# EasyEDA schematic SCH_Arduino扩展板_V1_2023-10-04.json

## Sheets
1 连接器: TITLE: Sheet_1; REV: 1.0; Date: 2022-09-22; Sheet: 1/1; Company: Your Company
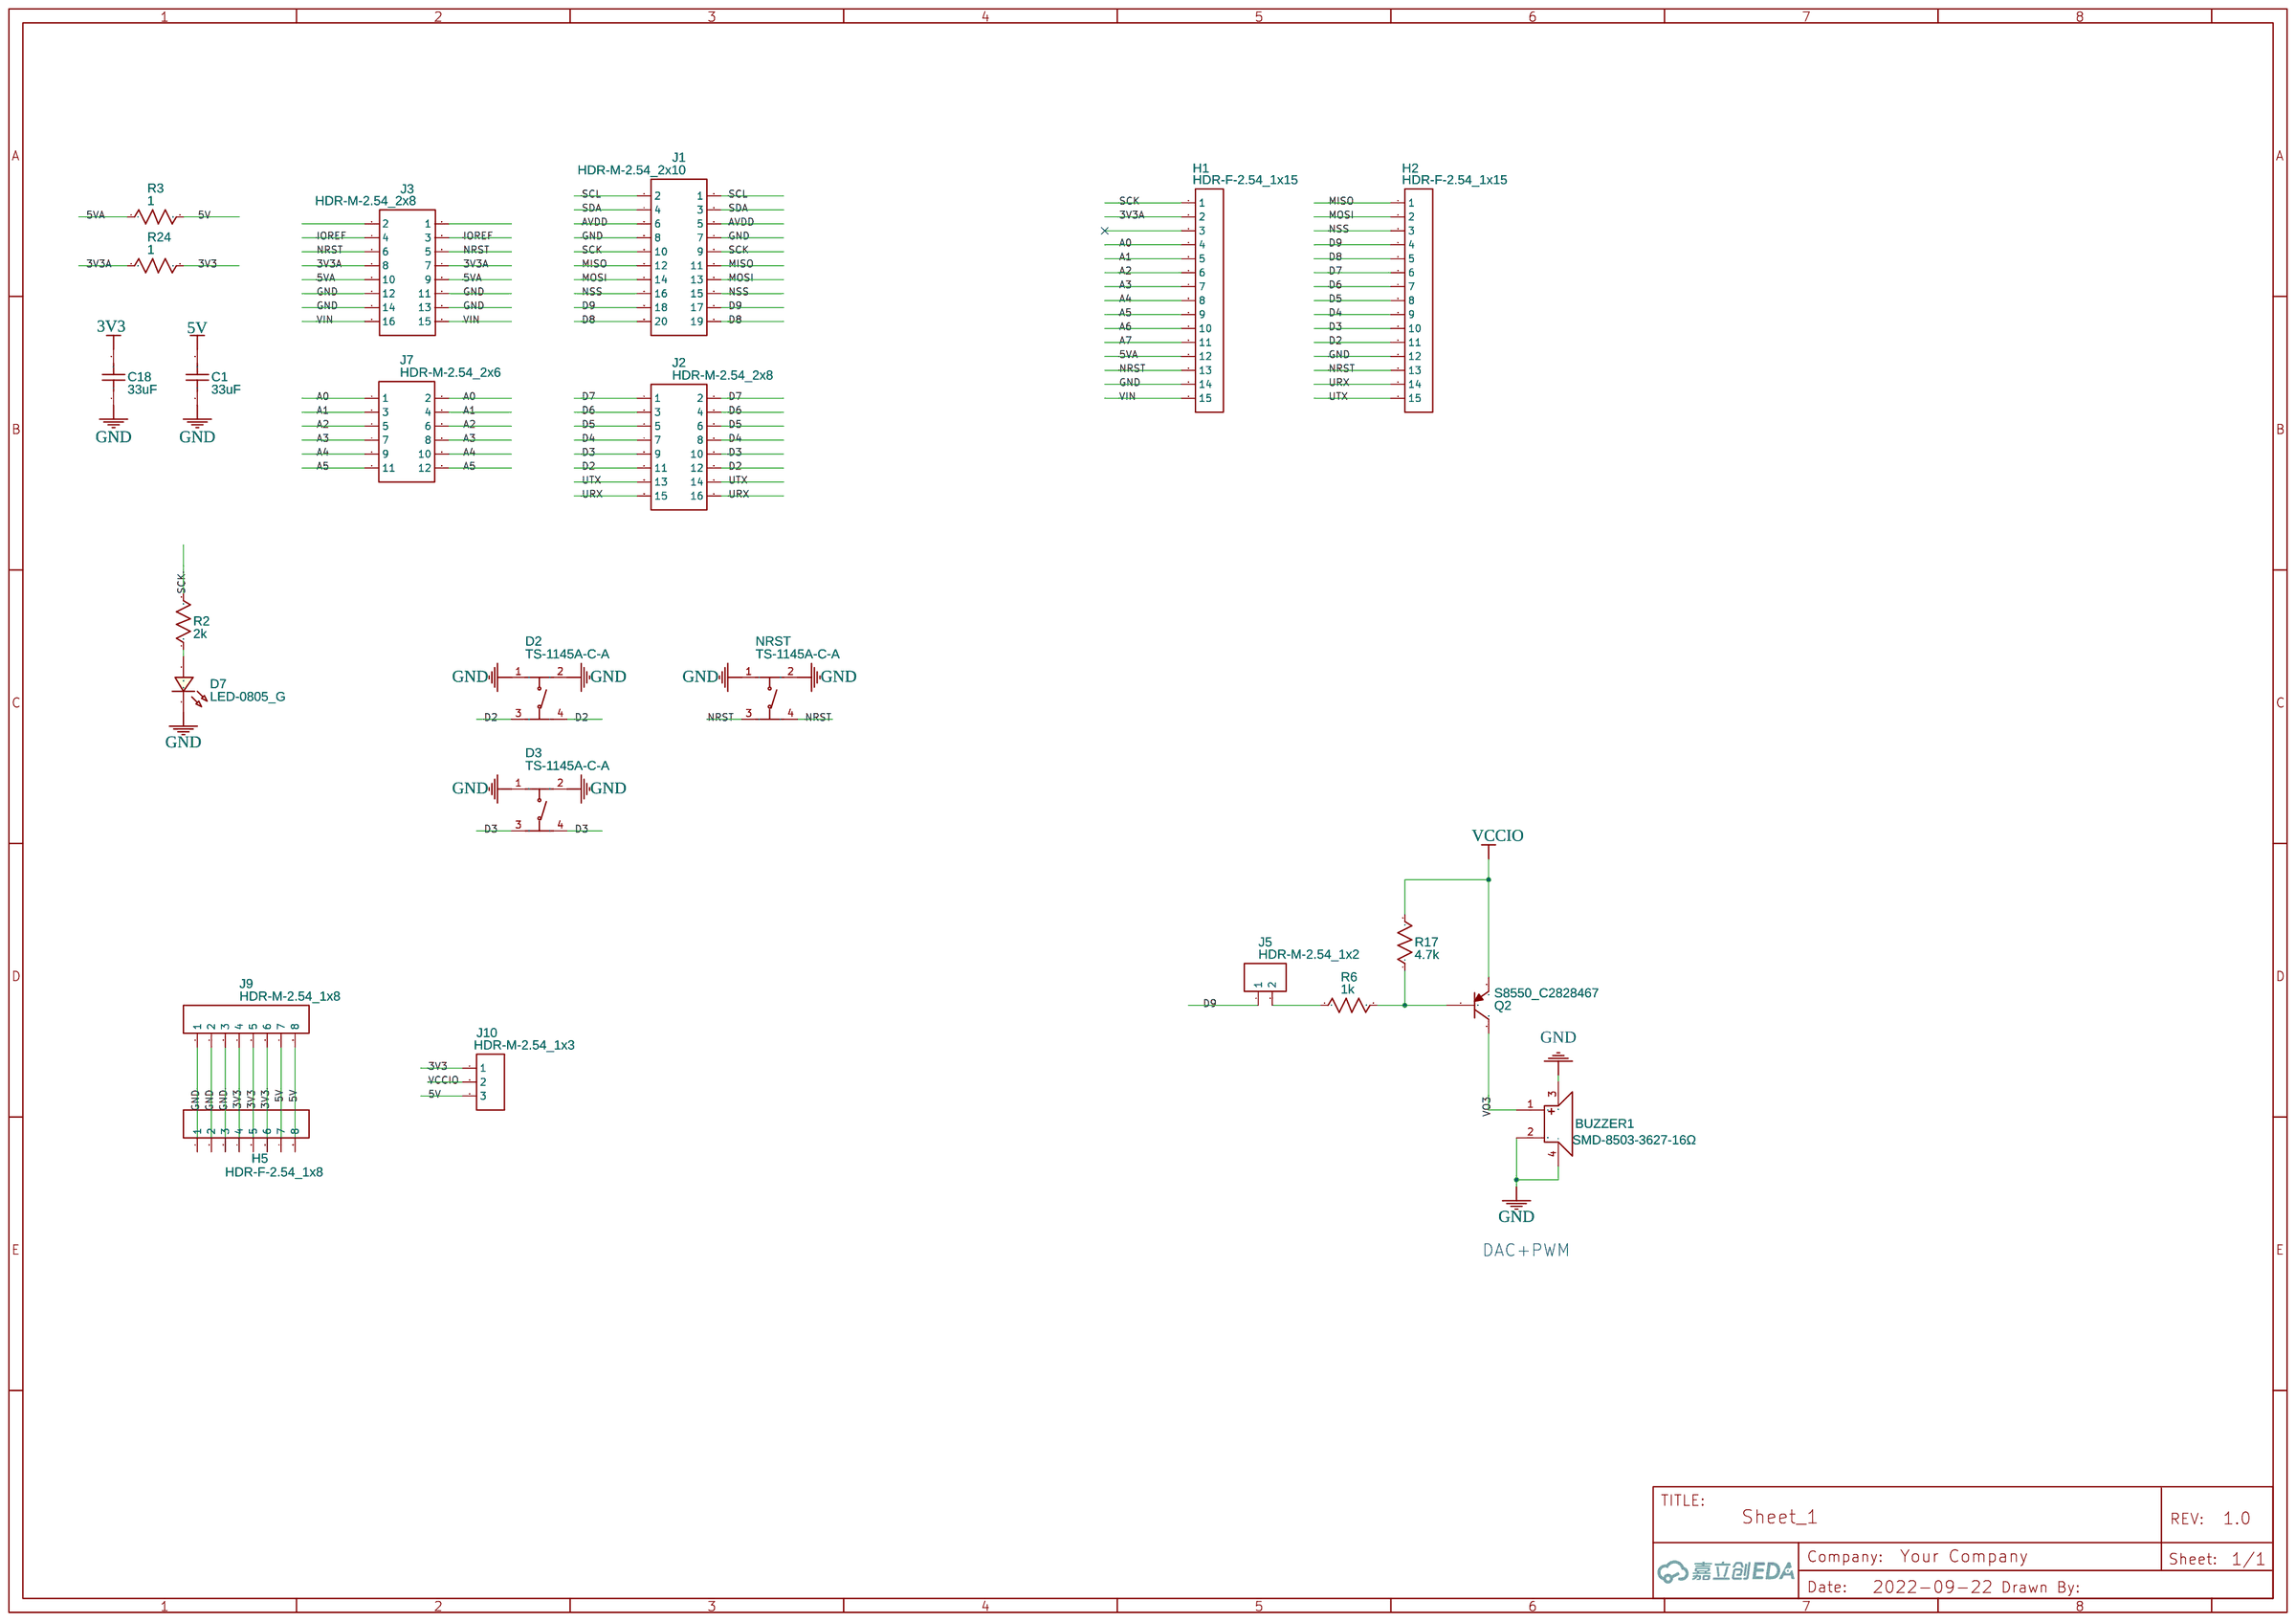
[diagram p0: 连接器]
2 连接器扩展: Date: 2022-10-17
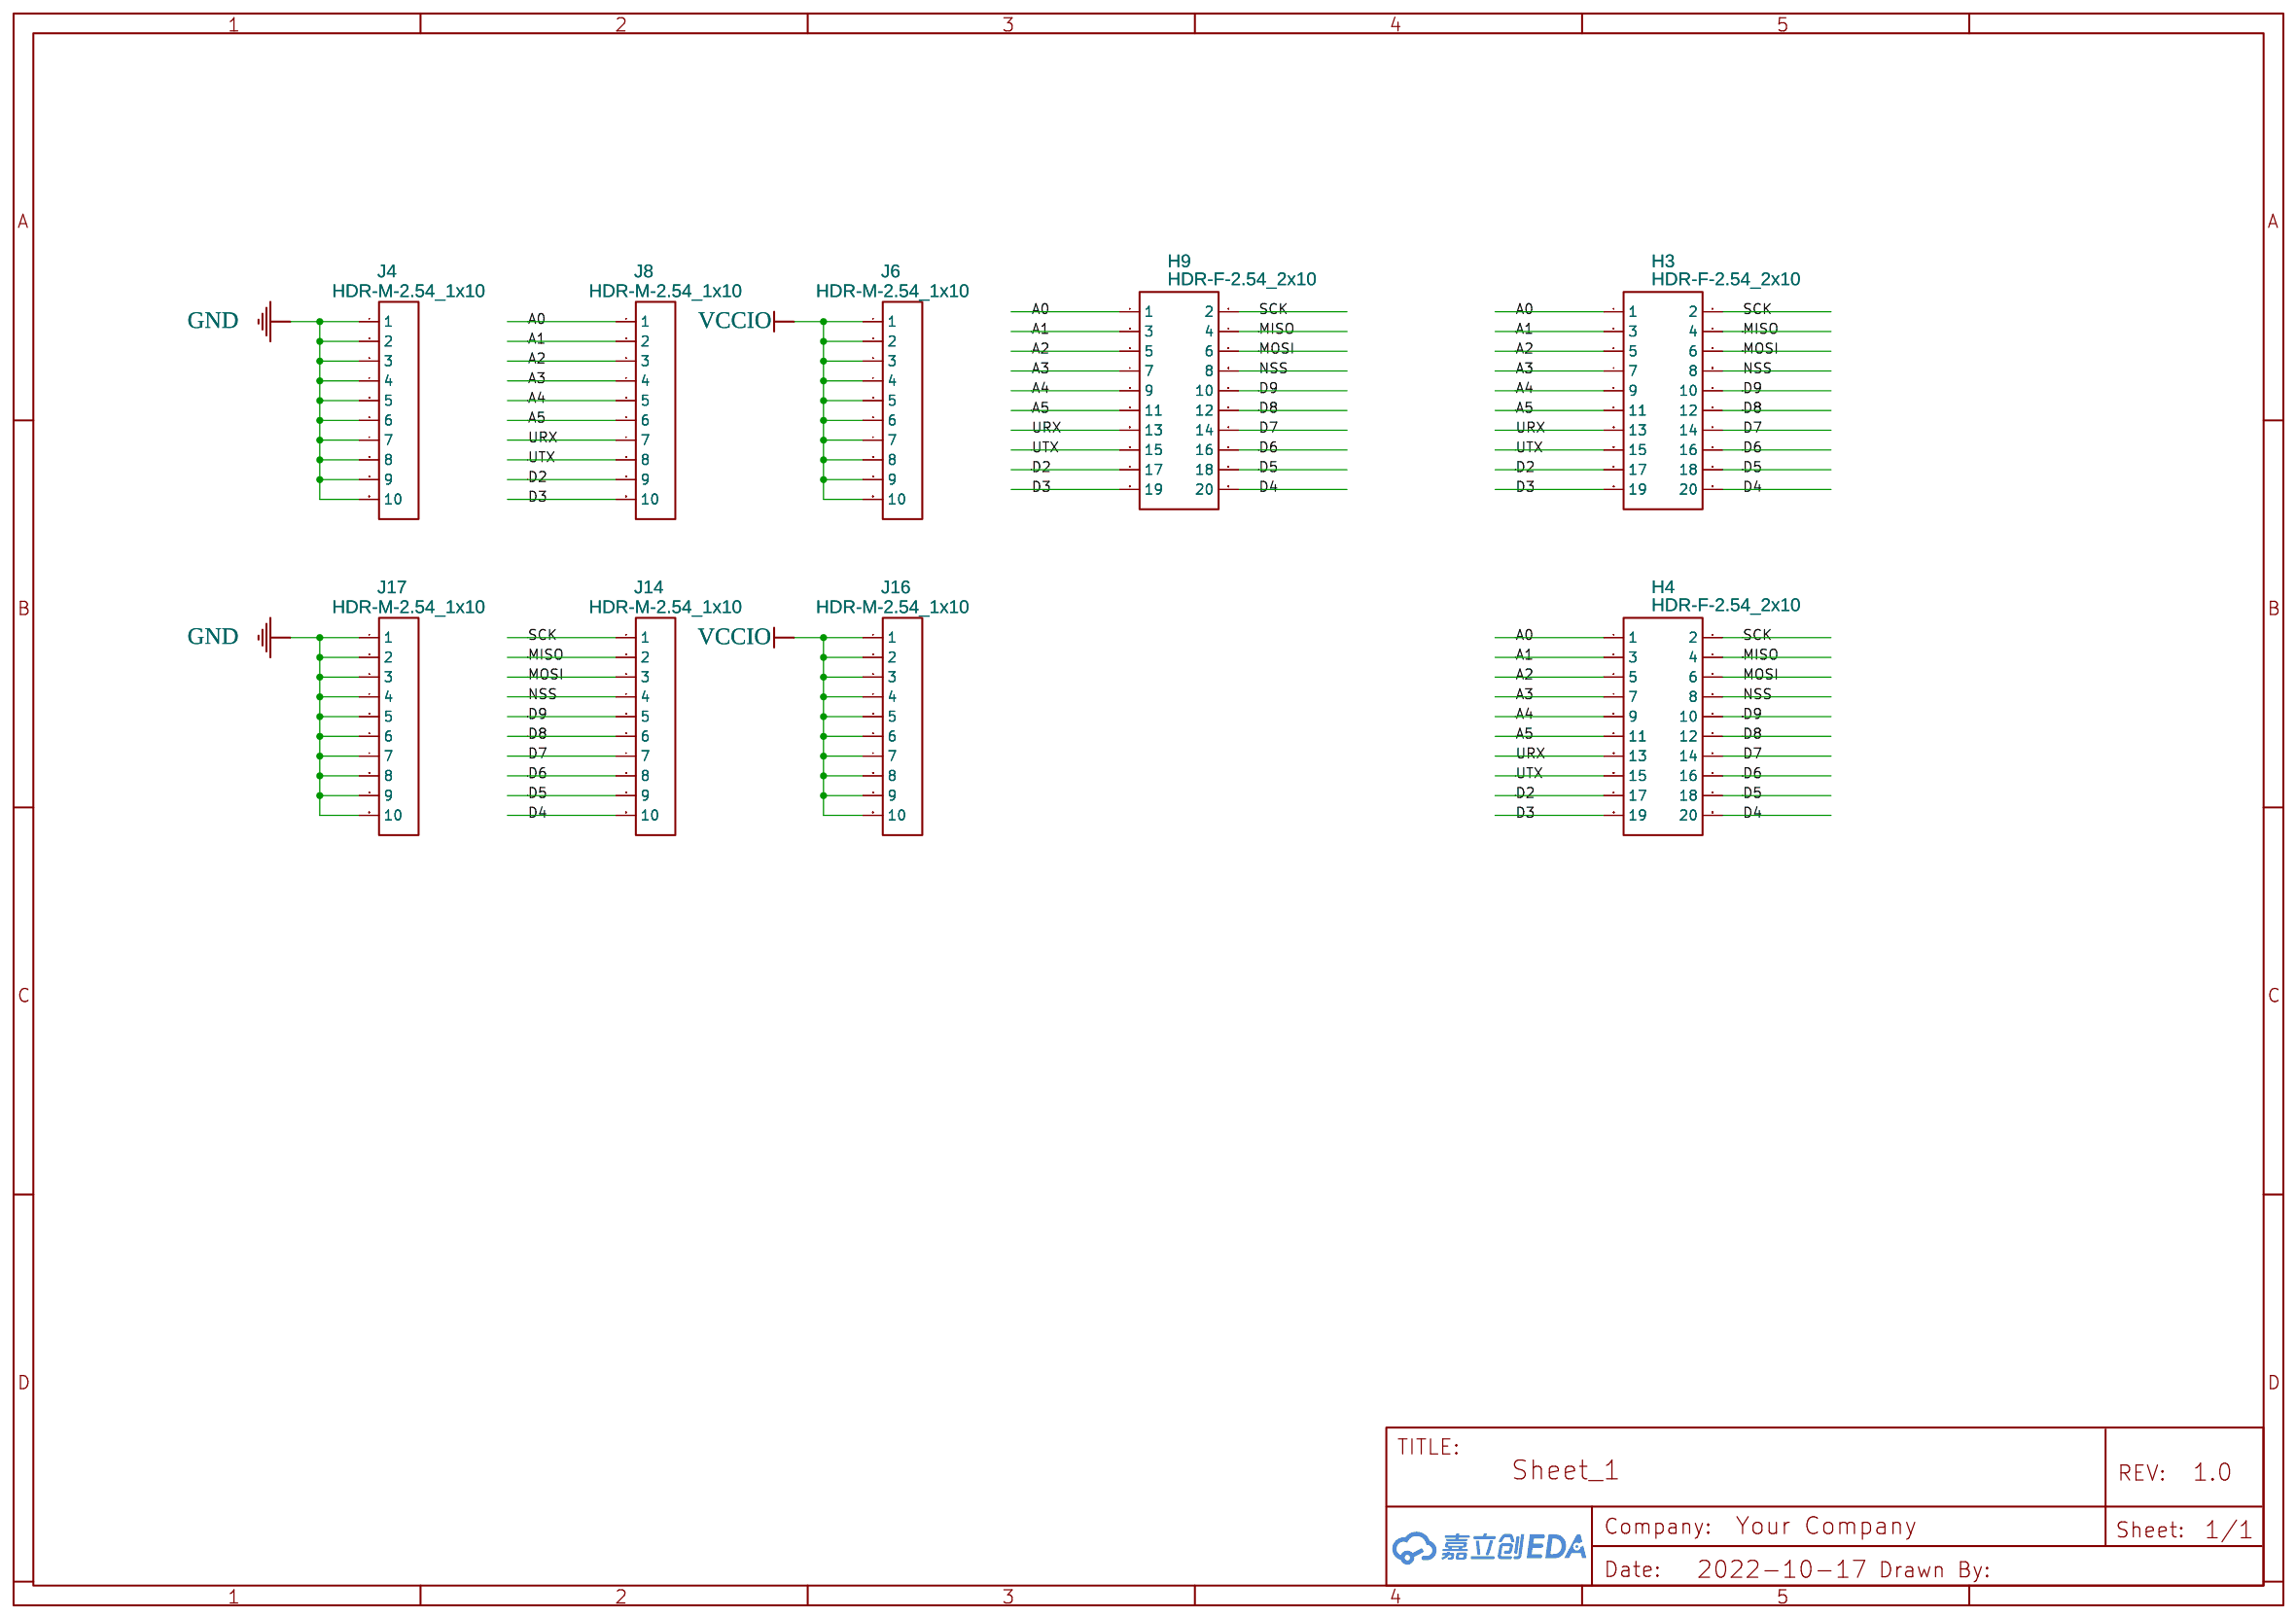
[diagram p1: 连接器扩展]

## Parts
sheet 连接器
BUZZER1  SMD-8503-3627-16Ω  [BUZ-SMD_4P-L8.5-W8.5-BR-1]
C1  33uF  [C1210]
C18  33uF  [C1210]
D2  TS-1145A-C-A  [SW-SMD_4P-L4.2-W3.2-P2.15-LS4.6]
D3  TS-1145A-C-A  [SW-SMD_4P-L4.2-W3.2-P2.15-LS4.6]
D7  LED-0805_G  [LED0805_GREEN]
H1  HDR-F-2.54_1x15  [HDR-F-2.54_1X15]
H2  HDR-F-2.54_1x15  [HDR-F-2.54_1X15]
H5  HDR-F-2.54_1x8  [HDR-F-2.54_1X8]
J1  HDR-M-2.54_2x10  [HDR-M-2.54_2X10]
J2  HDR-M-2.54_2x8  [HDR-M-2.54_2X8]
J3  HDR-M-2.54_2x8  [HDR-M-2.54_2X8]
J5  HDR-M-2.54_1x2  [HDR-M-2.54_1X2]
J7  HDR-M-2.54_2x6  [HDR-M-2.54_2X6]
J9  HDR-M-2.54_1x8  [HDR-M-2.54_1X8]
J10  HDR-M-2.54_1x3  [HDR-M-2.54_1X3]
NRST  TS-1145A-C-A  [SW-SMD_4P-L4.2-W3.2-P2.15-LS4.6]
Q2  S8550_C2828467  [SOT-23-3_L2.9-W1.3-P1.90-LS2.4-BR]
R2  2k  [R0805]
R3  1  [R0805]
R6  1k  [R0805]
R17  4.7k  [R0805]
R24  1  [R0805]
sheet 连接器扩展
H3  HDR-F-2.54_2x10  [HDR-F-2.54_2X10]
H4  HDR-F-2.54_2x10  [HDR-F-2.54_2X10]
H9  HDR-F-2.54_2x10  [HDR-F-2.54_2X10]
J4  HDR-M-2.54_1x10  [HDR-M-2.54_1X10]
J6  HDR-M-2.54_1x10  [HDR-M-2.54_1X10]
J8  HDR-M-2.54_1x10  [HDR-M-2.54_1X10]
J14  HDR-M-2.54_1x10  [HDR-M-2.54_1X10]
J16  HDR-M-2.54_1x10  [HDR-M-2.54_1X10]
J17  HDR-M-2.54_1x10  [HDR-M-2.54_1X10]

## Library data of the parts
BUZZER1 = SMD-8503-3627-16Ω: Supplier: LCSC; Supplier Part: C2685545; Manufacturer: S&S; Contributor: LCSC; JLCPCB Part Class: Extended Part
C1 C18 = C3225X5R0J336MT0A0N: Supplier: LCSC; Supplier Part: C695362; Manufacturer: TDK; Contributor: LCSC; JLCPCB Part Class: Extended Part
D2 D3 NRST = TS-1145A-C-A: Supplier: LCSC; Supplier Part: C318903; Manufacturer: XKB Enterprise; Contributor: LCSC; JLCPCB Part Class: Extended Part
D7 = LED-0805_G: Manufacturer: 国星光电; Manufacturer Part: NCD0805G1; Supplier Part: C84260; Contributor: LCEDA_Lib
H1 H2 = HDR-F-2.54_1x15: Supplier Part: C124408; Supplier: LCSC; Contributor: LCEDA_Lib
H5 = HDR-F-2.54_1x8: Supplier Part: C225505; Supplier: LCSC; Contributor: LCEDA_Lib
J1 = HDR-M-2.54_2x10: Supplier Part: C124359; Supplier: LCSC; Contributor: LCEDA_Lib
J2 J3 = HDR-M-2.54_2x8: Supplier Part: C68234; Supplier: LCSC; Contributor: LCEDA_Lib
J5 = HDR-M-2.54_1x2: Supplier Part: C124375; Supplier: LCSC; Contributor: LCEDA_Lib
J7 = HDR-M-2.54_2x6: Supplier Part: C124388; Supplier: LCSC; Contributor: LCEDA_Lib
J9 = HDR-M-2.54_1x8: Supplier Part: C190820; Supplier: LCSC; Contributor: LCEDA_Lib
J10 = HDR-M-2.54_1x3: Supplier Part: C180248; Supplier: LCSC; Contributor: LCEDA_Lib
Q2 = S8550_C2828467: Supplier: LCSC; Supplier Part: C2828467; Manufacturer: CBI(创基); Manufacturer Part: S8550; Contributor: LCSC; JLCPCB Part Class: Extended Part
R2 = R_0805_US: Supplier Part: C75781; Supplier: LCSC; Contributor: LCEDA_Lib; Manufacturer Part: TC0525F1001T5E; Manufacturer: UniOhm
R3 R6 R17 R24 = R_0805_US: Contributor: LCEDA_Lib
H3 H4 H9 = HDR-F-2.54_2x10: Supplier Part: C30867; Supplier: LCSC; Contributor: LCEDA_Lib
J4 J6 J8 J14 J16 J17 = HDR-M-2.54_1x10: Supplier Part: C57369; Supplier: LCSC; Contributor: LCEDA_Lib

## Nets
3V3: C18.2 H5.4 H5.5 H5.6 J9.4 J9.5 J9.6 J10.1 R24.2
3V3A: H1.2 J3.7 J3.8 R24.1
5V: C1.2 H5.7 H5.8 J9.7 J9.8 J10.3 R3.2
5VA: H1.12 J3.9 J3.10 R3.1
AVDD: J1.5 J1.6
GND: BUZZER1.2 BUZZER1.3 BUZZER1.4 C1.1 C18.1 D2.1 D2.2 D3.1 D3.2 D7.2 H1.14 H2.12 H5.1 H5.2 H5.3 J1.7 J1.8 J3.11 J3.12 J3.13 J3.14 J4.1 J4.2 J4.3 J4.4 J4.5 J4.6 J4.7 J4.8 J4.9 J4.10 J9.1 J9.2 J9.3 J17.1 J17.2 J17.3 J17.4 J17.5 J17.6 J17.7 J17.8 J17.9 J17.10 NRST.1 NRST.2
VCCIO: J6.1 J6.2 J6.3 J6.4 J6.5 J6.6 J6.7 J6.8 J6.9 J6.10 J10.2 J16.1 J16.2 J16.3 J16.4 J16.5 J16.6 J16.7 J16.8 J16.9 J16.10 Q2.2(E) R17.2
VIN: H1.15 J3.15 J3.16
A0: H1.4 H3.1 H4.1 H9.1 J7.1 J7.2 J8.1
A1: H1.5 H3.3 H4.3 H9.3 J7.3 J7.4 J8.2
A2: H1.6 H3.5 H4.5 H9.5 J7.5 J7.6 J8.3
A3: H1.7 H3.7 H4.7 H9.7 J7.7 J7.8 J8.4
A4: H1.8 H3.9 H4.9 H9.9 J7.9 J7.10 J8.5
A5: H1.9 H3.11 H4.11 H9.11 J7.11 J7.12 J8.6
A6: H1.10
A7: H1.11
D2: D2.3 D2.4 H2.11 H3.17 H4.17 H9.17 J2.11 J2.12 J8.9
D3: D3.3 D3.4 H2.10 H3.19 H4.19 H9.19 J2.9 J2.10 J8.10
D4: H2.9 H3.20 H4.20 H9.20 J2.7 J2.8 J14.10
D5: H2.8 H3.18 H4.18 H9.18 J2.5 J2.6 J14.9
D6: H2.7 H3.16 H4.16 H9.16 J2.3 J2.4 J14.8
D7: H2.6 H3.14 H4.14 H9.14 J2.1 J2.2 J14.7
D8: H2.5 H3.12 H4.12 H9.12 J1.19 J1.20 J14.6
D9: H2.4 H3.10 H4.10 H9.10 J1.17 J1.18 J5.1 J14.5
IOREF: J3.3 J3.4
MISO: H2.1 H3.4 H4.4 H9.4 J1.11 J1.12 J14.2
MOSI: H2.2 H3.6 H4.6 H9.6 J1.13 J1.14 J14.3
NRST: H1.13 H2.13 J3.5 J3.6 NRST.3 NRST.4
NSS: H2.3 H3.8 H4.8 H9.8 J1.15 J1.16 J14.4
SCK: H1.1 H3.2 H4.2 H9.2 J1.9 J1.10 J14.1 R2.2
SCL: J1.1 J1.2
SDA: J1.3 J1.4
URX: H2.14 H3.13 H4.13 H9.13 J2.15 J2.16 J8.7
UTX: H2.15 H3.15 H4.15 H9.15 J2.13 J2.14 J8.8
VO3: BUZZER1.1 Q2.3(C)
Net-(D7-1): D7.1 R2.1
Net-(J5-2): J5.2 R6.1
Net-(Q2-1): Q2.1(B) R6.2 R17.1

Not connected (* = marked no-connect by the designer): H1 3; J3 1 2

## Notes on the sheets
sheet 1
- DAC+PWM
